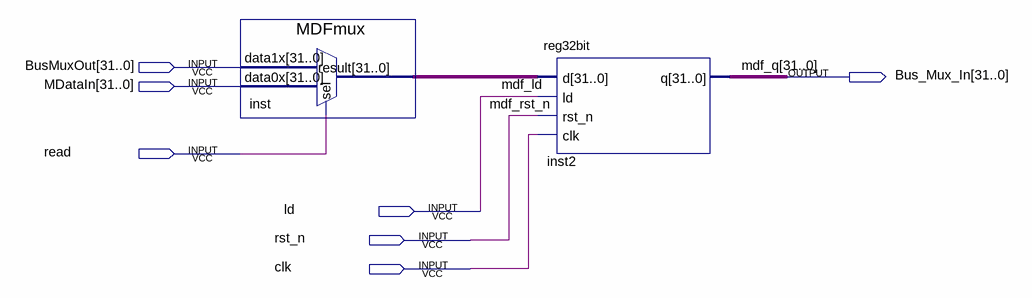
[diagram p0: schematic sheet]
// Quartus schematic MDF.bdf as structural Verilog: 2 symbols, 7 pins
module MDF (
  input  [31:0] BusMuxOut,
  input  [31:0] MDataIn,
  input  read,
  input  ld,
  input  rst_n,
  input  clk,
  output [31:0] Bus_Mux_In
);

  wire [31:0] inst_result;

  MDFmux inst (.data1x(BusMuxOut), .data0x(MDataIn), .sel(read), .result(inst_result));
  reg32bit inst2 (.d(inst_result), .ld(ld), .rst_n(rst_n), .clk(clk), .q(Bus_Mux_In));

  // Other names for the same wires on the sheet: mdf_ld = ld; mdf_q[31:0] = Bus_Mux_In; mdf_rst_n = rst_n
endmodule
